# Altium schematic sheet Processing interface.SchDoc: Processing interface
size A4; Author: Maxime Tousignant-Tremblay; Revision: 1; SheetNumber: 1; SheetTotal: 4
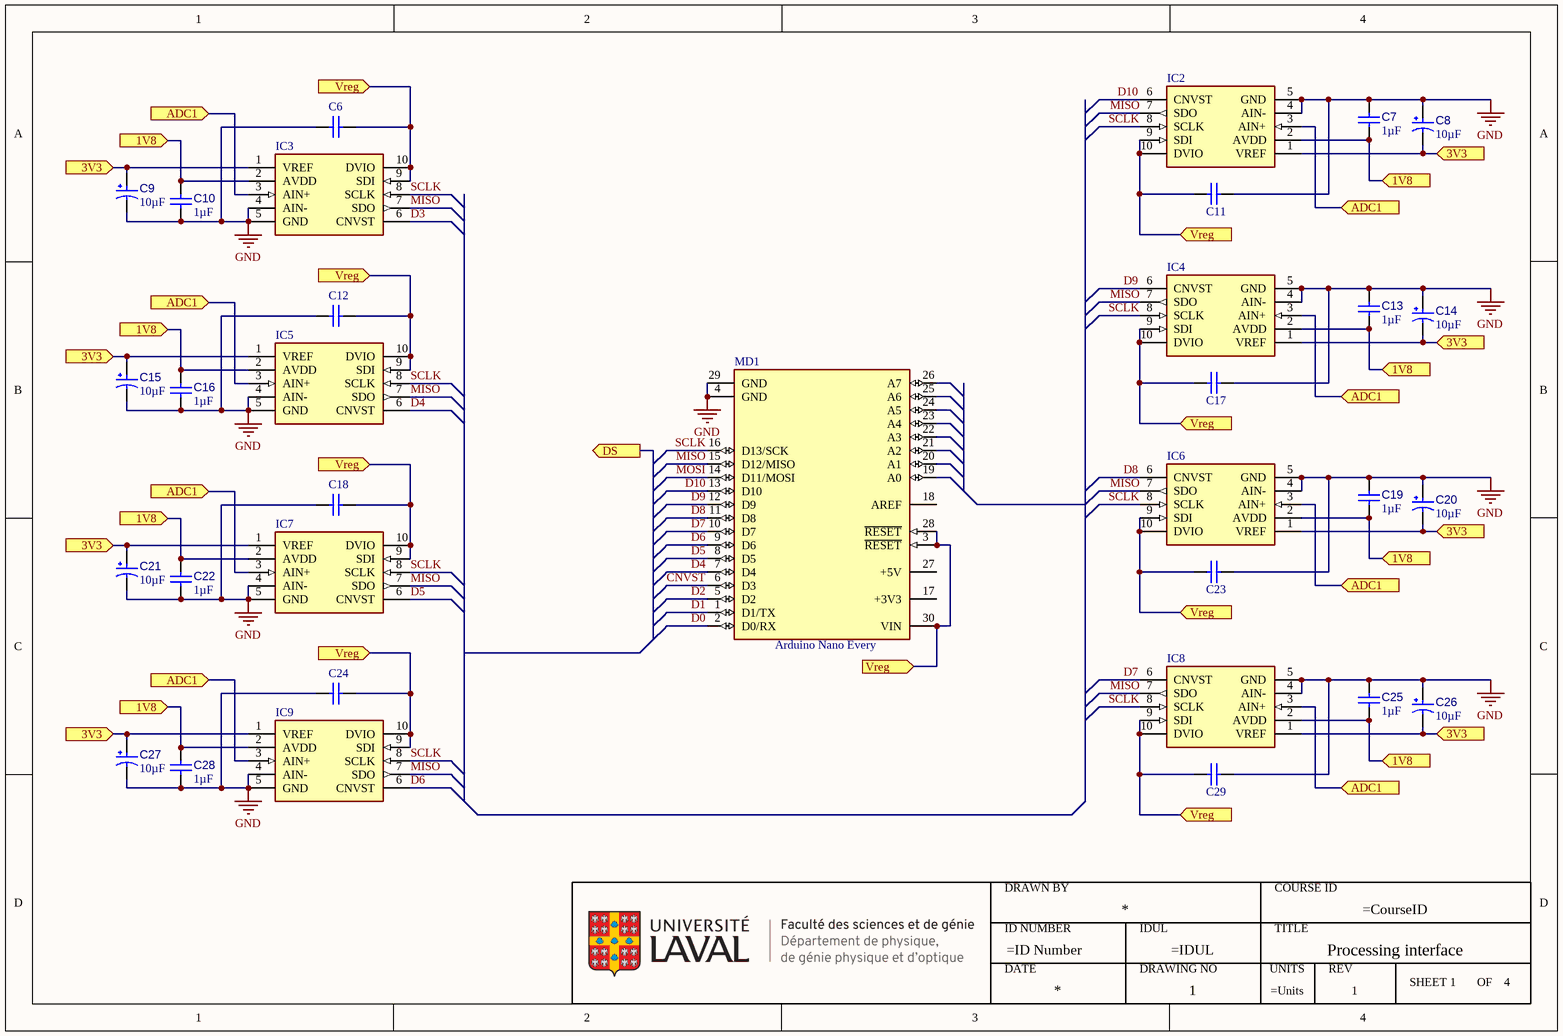
[diagram p0: Processing interface.SchDoc]

## Parts
*4  ULaval FSG-DPGPO  (value not drawn)
C6  0402YC104KAT2A  [CAPC1005X56X25ML10T15]  (value not drawn)
C7  value 1µF  [CAPC0603(1608)100_L]  (hidden comment: Capacitor 1µF +/-0.1% 25V 0603)
C8  value 10µF  [CAPMP3217X18-T_V]  (hidden comment: TAJA106K016RNJ)
C9  value 10µF  [CAPMP3217X18-T_V]  (hidden comment: TAJA106K016RNJ)
C10  value 1µF  [CAPC0603(1608)100_L]  (hidden comment: Capacitor 1µF +/-0.1% 25V 0603)
C11  0402YC104KAT2A  [CAPC1005X56X25ML10T15]  (value not drawn)
C12  0402YC104KAT2A  [CAPC1005X56X25ML10T15]  (value not drawn)
C13  value 1µF  [CAPC0603(1608)100_L]  (hidden comment: Capacitor 1µF +/-0.1% 25V 0603)
C14  value 10µF  [CAPMP3217X18-T_V]  (hidden comment: TAJA106K016RNJ)
C15  value 10µF  [CAPMP3217X18-T_V]  (hidden comment: TAJA106K016RNJ)
C16  value 1µF  [CAPC0603(1608)100_L]  (hidden comment: Capacitor 1µF +/-0.1% 25V 0603)
C17  0402YC104KAT2A  [CAPC1005X56X25ML10T15]  (value not drawn)
C18  0402YC104KAT2A  [CAPC1005X56X25ML10T15]  (value not drawn)
C19  value 1µF  [CAPC0603(1608)100_L]  (hidden comment: Capacitor 1µF +/-0.1% 25V 0603)
C20  value 10µF  [CAPMP3217X18-T_V]  (hidden comment: TAJA106K016RNJ)
C21  value 10µF  [CAPMP3217X18-T_V]  (hidden comment: TAJA106K016RNJ)
C22  value 1µF  [CAPC0603(1608)100_L]  (hidden comment: Capacitor 1µF +/-0.1% 25V 0603)
C23  0402YC104KAT2A  [CAPC1005X56X25ML10T15]  (value not drawn)
C24  0402YC104KAT2A  [CAPC1005X56X25ML10T15]  (value not drawn)
C25  value 1µF  [CAPC0603(1608)100_L]  (hidden comment: Capacitor 1µF +/-0.1% 25V 0603)
C26  value 10µF  [CAPMP3217X18-T_V]  (hidden comment: TAJA106K016RNJ)
C27  value 10µF  [CAPMP3217X18-T_V]  (hidden comment: TAJA106K016RNJ)
C28  value 1µF  [CAPC0603(1608)100_L]  (hidden comment: Capacitor 1µF +/-0.1% 25V 0603)
C29  0402YC104KAT2A  [CAPC1005X56X25ML10T15]  (value not drawn)
IC2  MCP33141-10-E/MS  [New footprint 1]  (value not drawn)
IC3  MCP33141-10-E/MS  [New footprint 1]  (value not drawn)
IC4  MCP33141-10-E/MS  [New footprint 1]  (value not drawn)
IC5  MCP33141-10-E/MS  [New footprint 1]  (value not drawn)
IC6  MCP33141-10-E/MS  [New footprint 1]  (value not drawn)
IC7  MCP33141-10-E/MS  [New footprint 1]  (value not drawn)
IC8  MCP33141-10-E/MS  [New footprint 1]  (value not drawn)
IC9  MCP33141-10-E/MS  [New footprint 1]  (value not drawn)
MD1  Arduino Nano Every  [FP-A000005-MFG]

## Ports
1V8 (in, see Power Supply Unit[4C], Processing interface[1A], Processing interface[1B], Processing interface[1C], Processing interface[4A], Processing interface[4B], Processing interface[4C]), 1V8 (in, see Power Supply Unit[4C], Processing interface[1A], Processing interface[1B], Processing interface[1C], Processing interface[4A], Processing interface[4C]), 1V8 (in, see Power Supply Unit[4C], Processing interface[1A], Processing interface[1B], Processing interface[1C], Processing interface[4B], Processing interface[4C]), 1V8 (in, see Power Supply Unit[4C], Processing interface[1A], Processing interface[1C], Processing interface[4A], Processing interface[4B], Processing interface[4C]), 1V8 (in, see Power Supply Unit[4C], Processing interface[1B], Processing interface[1C], Processing interface[4A], Processing interface[4B], Processing interface[4C]), 3V3 (in, see Power Supply Unit[4B], Processing interface[1A], Processing interface[1B], Processing interface[1C], Processing interface[4A], Processing interface[4B], Processing interface[4C], Weatstone bridge[2B]), 3V3 (in, see Power Supply Unit[4B], Processing interface[1A], Processing interface[1B], Processing interface[1C], Processing interface[4A], Processing interface[4C], Weatstone bridge[2B]), 3V3 (in, see Power Supply Unit[4B], Processing interface[1A], Processing interface[1B], Processing interface[1C], Processing interface[4B], Processing interface[4C], Weatstone bridge[2B]), 3V3 (in, see Power Supply Unit[4B], Processing interface[1A], Processing interface[1C], Processing interface[4A], Processing interface[4B], Processing interface[4C], Weatstone bridge[2B]), 3V3 (in, see Power Supply Unit[4B], Processing interface[1B], Processing interface[1C], Processing interface[4A], Processing interface[4B], Processing interface[4C], Weatstone bridge[2B]), ADC1 (in, see Processing interface[1A], Processing interface[1B], Processing interface[1C], Processing interface[4A], Processing interface[4B], Processing interface[4C], Processing interface[4D], Weatstone bridge[4B]), ADC1 (in, see Processing interface[1A], Processing interface[1B], Processing interface[1C], Processing interface[4A], Processing interface[4B], Processing interface[4C], Weatstone bridge[4B]), ADC1 (in, see Processing interface[1A], Processing interface[1B], Processing interface[1C], Processing interface[4A], Processing interface[4B], Processing interface[4D], Weatstone bridge[4B]), ADC1 (in, see Processing interface[1A], Processing interface[1B], Processing interface[1C], Processing interface[4A], Processing interface[4C], Processing interface[4D], Weatstone bridge[4B]), ADC1 (in, see Processing interface[1A], Processing interface[1B], Processing interface[1C], Processing interface[4B], Processing interface[4C], Processing interface[4D], Weatstone bridge[4B]), ADC1 (in, see Processing interface[1A], Processing interface[1B], Processing interface[4A], Processing interface[4B], Processing interface[4C], Processing interface[4D], Weatstone bridge[4B]), ADC1 (in, see Processing interface[1B], Processing interface[1C], Processing interface[4A], Processing interface[4B], Processing interface[4C], Processing interface[4D], Weatstone bridge[4B]), DS (out, see Weatstone bridge[2B]), Vreg (in, see Power Supply Unit[3B], Processing interface[1A], Processing interface[1B], Processing interface[1C], Processing interface[3C], Processing interface[4A], Processing interface[4B], Processing interface[4C], Processing interface[4D], Weatstone bridge[2B], Weatstone bridge[2C], Weatstone bridge[3B]), Vreg (in, see Power Supply Unit[3B], Processing interface[1A], Processing interface[1B], Processing interface[1C], Processing interface[3C], Processing interface[4A], Processing interface[4B], Processing interface[4C], Weatstone bridge[2B], Weatstone bridge[2C], Weatstone bridge[3B]), Vreg (in, see Power Supply Unit[3B], Processing interface[1A], Processing interface[1B], Processing interface[1C], Processing interface[3C], Processing interface[4A], Processing interface[4B], Processing interface[4D], Weatstone bridge[2B], Weatstone bridge[2C], Weatstone bridge[3B]), Vreg (in, see Power Supply Unit[3B], Processing interface[1A], Processing interface[1B], Processing interface[1C], Processing interface[3C], Processing interface[4A], Processing interface[4C], Processing interface[4D], Weatstone bridge[2B], Weatstone bridge[2C], Weatstone bridge[3B]), Vreg (in, see Power Supply Unit[3B], Processing interface[1A], Processing interface[1B], Processing interface[1C], Processing interface[3C], Processing interface[4B], Processing interface[4C], Processing interface[4D], Weatstone bridge[2B], Weatstone bridge[2C], Weatstone bridge[3B]), Vreg (in, see Power Supply Unit[3B], Processing interface[1A], Processing interface[1B], Processing interface[1C], Processing interface[4A], Processing interface[4B], Processing interface[4C], Processing interface[4D], Weatstone bridge[2B], Weatstone bridge[2C], Weatstone bridge[3B]), Vreg (in, see Power Supply Unit[3B], Processing interface[1A], Processing interface[1B], Processing interface[3C], Processing interface[4A], Processing interface[4B], Processing interface[4C], Processing interface[4D], Weatstone bridge[2B], Weatstone bridge[2C], Weatstone bridge[3B]), Vreg (in, see Power Supply Unit[3B], Processing interface[1B], Processing interface[1C], Processing interface[3C], Processing interface[4A], Processing interface[4B], Processing interface[4C], Processing interface[4D], Weatstone bridge[2B], Weatstone bridge[2C], Weatstone bridge[3B])

## Nets
GND: C6.1 C7.2 C8.1 C9.2 C10.2 C11.1 C12.1 C13.2 C14.1 C15.2 C16.2 C17.1 C18.1 C19.2 C20.1 C21.2 C22.2 C23.1 C24.1 C25.2 C26.1 C27.2 C28.2 C29.1 IC2.4(AIN-) IC2.5(GND) IC3.4(AIN-) IC3.5(GND) IC4.4(AIN-) IC4.5(GND) IC5.4(AIN-) IC5.5(GND) IC6.4(AIN-) IC6.5(GND) IC7.4(AIN-) IC7.5(GND) IC8.4(AIN-) IC8.5(GND) IC9.4(AIN-) IC9.5(GND) MD1.4(GND) MD1.29(GND)
1V8: C7.1 C10.1 C13.1 C16.1 C19.1 C22.1 C25.1 C28.1 IC2.2(AVDD) IC3.2(AVDD) IC4.2(AVDD) IC5.2(AVDD) IC6.2(AVDD) IC7.2(AVDD) IC8.2(AVDD) IC9.2(AVDD) ; port 1V8
3V3: C8.2 C9.1 C14.2 C15.1 C20.2 C21.1 C26.2 C27.1 IC2.1(VREF) IC3.1(VREF) IC4.1(VREF) IC5.1(VREF) IC6.1(VREF) IC7.1(VREF) IC8.1(VREF) IC9.1(VREF) ; port 3V3
ADC1: IC2.3(AIN+) IC3.3(AIN+) IC4.3(AIN+) IC5.3(AIN+) IC6.3(AIN+) IC7.3(AIN+) IC8.3(AIN+) IC9.3(AIN+) ; port ADC1
CNVST: MD1.6(D3)
D0: MD1.2(D0/RX)
D1: MD1.1(D1/TX)
D2: MD1.5(D2)
D3: IC3.6(CNVST)
D4: IC5.6(CNVST) MD1.7(D4)
D5: IC7.6(CNVST) MD1.8(D5)
D6: IC9.6(CNVST) MD1.9(D6)
D7: IC8.6(CNVST) MD1.10(D7)
D8: IC6.6(CNVST) MD1.11(D8)
D9: IC4.6(CNVST) MD1.12(D9)
D10: IC2.6(CNVST) MD1.13(D10)
MISO: IC2.7(SDO) IC3.7(SDO) IC4.7(SDO) IC5.7(SDO) IC6.7(SDO) IC7.7(SDO) IC8.7(SDO) IC9.7(SDO) MD1.15(D12/MISO)
MOSI: MD1.14(D11/MOSI)
SCLK: IC2.8(SCLK) IC3.8(SCLK) IC4.8(SCLK) IC5.8(SCLK) IC6.8(SCLK) IC7.8(SCLK) IC8.8(SCLK) IC9.8(SCLK) MD1.16(D13/SCK)
Vreg: C6.2 C11.2 C12.2 C17.2 C18.2 C23.2 C24.2 C29.2 IC2.9(SDI) IC2.10(DVIO) IC3.9(SDI) IC3.10(DVIO) IC4.9(SDI) IC4.10(DVIO) IC5.9(SDI) IC5.10(DVIO) IC6.9(SDI) IC6.10(DVIO) IC7.9(SDI) IC7.10(DVIO) IC8.9(SDI) IC8.10(DVIO) IC9.9(SDI) IC9.10(DVIO) MD1.3(~{RESET}) MD1.28(~{RESET}) MD1.30(VIN) ; port Vreg

Not connected (* = marked no-connect by the designer): MD1 17(+3V3) 18(AREF) 19(A0) 20(A1) 21(A2) 22(A3) 23(A4) 24(A5) 25(A6) 26(A7) 27(+5V)

## Notes on the sheet
- (in symbol ULaval FSG-DPGPO) DRAWN BY; COURSE ID; ID NUMBER; IDUL; TITLE; DATE; DRAWING NO; UNITS; REV; SHEET; OF

## Library data of the parts
C6 C11 C12 C17 C18 C23 C24 C29 = CMP-2008-02800-1: Manufacturer: AVX Interconnect / Elco; Part Number: 0402YC104KAT2A
C7 C10 C13 C16 C19 C22 C25 C28 = CMP-001-00055-4: Chip Capacitor, 1µF +/-0.1%, 25V, 0603, Thickness 1 mm; Tolerance: 20%; Min Operating Temperature: -55°C; Max Operating Temperature: 85°C; Voltage Rating: 25V; Mounting Technology: SMT; Case/Package: 0603; Pins: 2
C8 C9 C14 C15 C20 C21 C26 C27 = CMP-001-00041-7: Standard Tantalum, 10 uF, +/- 10%, 16 V, -55 to 125 degC, 1206 (3216 Metric), RoHS, Tape and Reel; Manufacturer: AVX; Voltage Rating: 16V; ESR: 3Ohm; Datasheet URL: http://datasheets.avx.com/TAJ.pdf; Package URL: http://www.avx.com/download/software/literature/AVX-Footprint-Library.pdf; Pins: 2; Package Reference: CAPMP3217X18-T; RoHS Compliant: True; Case/Package: 1206; Max Operating Temperature: 125°C; Package Description: 2-Pin Surface Mount Device, Body 3.2 x 1.65 mm; Mounting Technology: SM; Tolerance: 10%; Package Quantity: 1; Packaging: TapeandReel; Min Operating Temperature: -55°C; Datasheet Version: Feb-16; Manufacturer URL: http://www.avx.com/; Capacitor Type: Tantalum
IC2-IC9 = CMP-020-00028-2: ADC Single SAR 1Msps 12-bit Serial Microwire/SPI 10-Pin MSOP Tray
MD1 = CMP-189986-000002-1: ARDUINO NANO ATMEGA328 EVAL BRD; Number of Bits: 8; Evaluation Kit: Yes; Operating Supply Voltage: 12V; Interface: I2C; Data Bus Width: 8b; Core Architecture: AVR; Packaging: Bulk; Length: 7inch; Package Quantity: 50; Width: 5inch; REACH SVHC: No SVHC; Weight: 0.358383oz; Series: AVR® ATmega; Height: 0.25inch